# Altium project DE-060418.PrjPcb
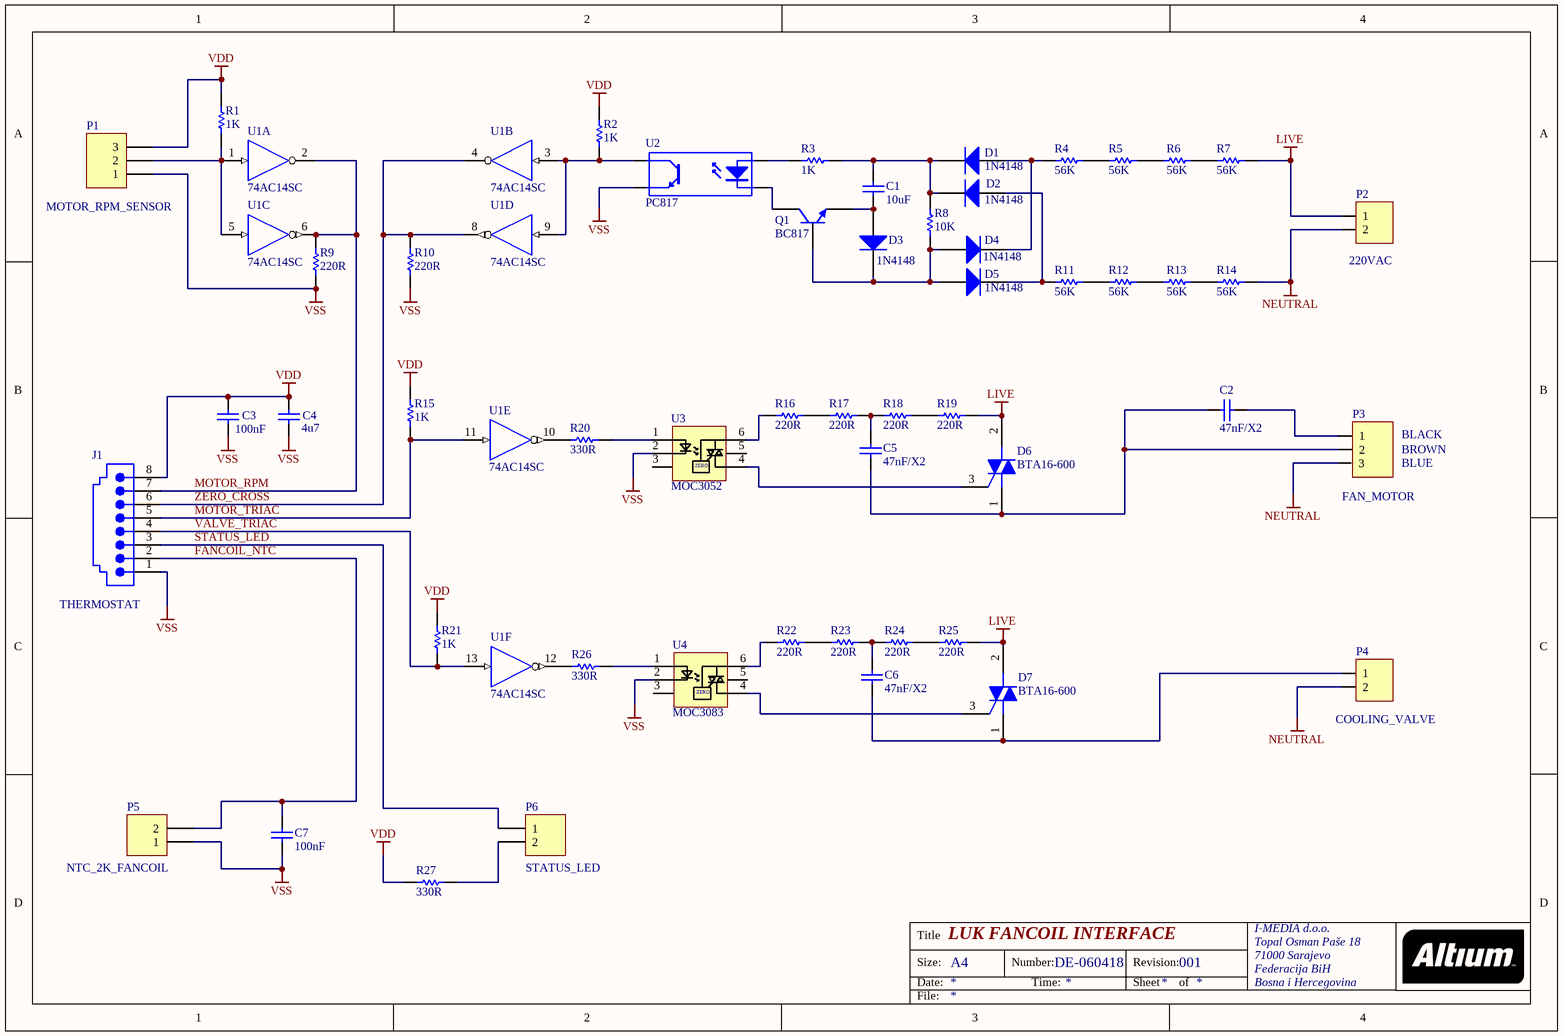
[diagram p0: DE-060418.SchDoc]
1 sheet, 53 parts. Net scope: global (net labels, ports and power ports of the same name join across sheets).
Board file: DE-060418.PcbDoc

## Sheet DE-060418.SchDoc: LUK FANCOIL INTERFACE
size A4; Author: Eldar Dedic; DrawnBy: eldar6776@hotmail.com; Organization: I-MEDIA d.o.o.; Address1: Topal Osman Paše 18; Address2: 71000 Sarajevo; Address3: Federacija BiH; Address4: Bosna i Hercegovina; DocumentNumber: DE-060418; Revision: 001

### Parts
C1  value 10uF  [0805]  (hidden comment: 4u7)
C2  47nF/X2  [VP52-2.5]
C3  100nF  [0603]
C4  4u7  [0805]
C5  47nF/X2  [VP52-2.5]
C6  47nF/X2  [VP52-2.5]
C7  100nF  [0603]
D1  1N4148  [SOD323]
D2  1N4148  [SOD323]
D3  1N4148  [SOD323]
D4  1N4148  [SOD323]
D5  1N4148  [SOD323]
D6  BTA16-600  [ONSC-TO-220-3-221A-07]
D7  BTA16-600  [ONSC-TO-220-3-221A-07]
J1  THERMOSTAT  [15-43-8501]
P1  MOTOR_RPM_SENSOR  [HDR1X3]
P2  220VAC  [TERMINAL BLOK 2]
P3  FAN_MOTOR  [TERMINAL BLOK 3]
P4  COOLING_VALVE  [TERMINAL BLOK 2]
P5  NTC_2K_FANCOIL  [HDR1X2]
P6  STATUS_LED  [HDR1X2]
Q1  BC817  [SOT23_N]
R1  1K  [6-0805]
R2  1K  [6-0805]
R3  1K  [6-0805]
R4  56K  [6-0805]
R5  56K  [6-0805]
R6  56K  [6-0805]
R7  56K  [6-0805]
R8  10K  [6-0805]
R9  220R  [6-0805]
R10  220R  [6-0805]
R11  56K  [6-0805]
R12  56K  [6-0805]
R13  56K  [6-0805]
R14  56K  [6-0805]
R15  1K  [6-0805]
R16  220R  [6-0805]
R17  220R  [6-0805]
R18  220R  [6-0805]
R19  220R  [6-0805]
R20  330R  [6-0805]
R21  1K  [6-0805]
R22  220R  [6-0805]
R23  220R  [6-0805]
R24  220R  [6-0805]
R25  220R  [6-0805]
R26  330R  [6-0805]
R27  330R  [6-0805]
U1  74AC14SC  [M14A_N]  (parts A,B,C,D,E,F of 6)
U2  PC817  [DIP-4]
U3  MOC3052  [DIP6]
U4  MOC3083  [DIP6]

### Nets
LIVE: D6.2(MT2) D7.2(MT2) P2.1 R7.2 R19.2 R25.2
NEUTRAL: P2.2 P3.3 P4.2 R14.2
VDD: C3.2 C4.2 J1.8 P1.3 R1.1 R2.1 R15.1 R21.1 R27.1 U1.14(VDD)
VSS: C3.1 C4.1 C7.1 J1.1 P1.1 P5.1 R9.2 R10.2 U1.7(VSS) U2.3(E) U3.2 U4.2
FANCOIL_NTC: C7.2 J1.2 P5.2
MOTOR_RPM: J1.7 R9.1 U1.2(~{O}) U1.6(~{O})
MOTOR_TRIAC: J1.5 R15.2 U1.11(I)
STATUS_LED: J1.3 P6.1
VALVE_TRIAC: J1.4 R21.2 U1.13(I)
ZERO_CROSS: J1.6 R10.1 U1.4(~{O}) U1.8(~{O})
NetC1_1: C1.1 D3.2(A) Q1.2(E)
NetC1_2: C1.2 D1.1(K) D2.1(K) R3.2 R8.2
NetC2_1: C2.1 C5.1 D6.1(MT1) P3.2
NetC2_2: C2.2 P3.1
NetC5_2: C5.2 R17.2 R18.1
NetC6_1: C6.1 D7.1(MT1) P4.1
NetC6_2: C6.2 R23.2 R24.1
NetD1_2: D1.2(A) D4.1(K) R4.1
NetD2_2: D2.2(A) D5.1(K) R11.1
NetD3_1: D3.1(K) D4.2(A) D5.2(A) Q1.1(B) R8.1
NetD6_3: D6.3(G) U3.4
NetD7_3: D7.3(G) U4.4
NetP1_2: P1.2 R1.2 U1.1(I) U1.5(I)
NetP6_2: P6.2 R27.2
NetQ1_3: Q1.3(C) U2.2(K)
NetR2_2: R2.2 U1.3(I) U1.9(I) U2.4(C)
NetR3_1: R3.1 U2.1(A)
NetR4_2: R4.2 R5.1
NetR5_2: R5.2 R6.1
NetR6_2: R6.2 R7.1
NetR11_2: R11.2 R12.1
NetR12_2: R12.2 R13.1
NetR13_2: R13.2 R14.1
NetR16_1: R16.1 U3.6
NetR16_2: R16.2 R17.1
NetR18_2: R18.2 R19.1
NetR20_1: R20.1 U3.1
NetR20_2: R20.2 U1.10(~{O})
NetR22_1: R22.1 U4.6
NetR22_2: R22.2 R23.1
NetR24_2: R24.2 R25.1
NetR26_1: R26.1 U4.1
NetR26_2: R26.2 U1.12(~{O})

Not connected (* = marked no-connect by the designer): U3 3 5; U4 3 5

### Notes on the sheet
- (near P3) BLACK
- (near P3) BLUE
- (near P3) BROWN
- Title
- Size:
- Date:
- A4
- Number:
- Time:
- Revision:
- Sheet
- of
- File:
- (in symbol MOC3081) ZERO

### Library data of the parts
C1 C4 = C0805: Ceramic Chip Capacitor - Standard; Note: Footprint corresponds to dimensions for bulk cassette packaging. This case size has tightened tolerances.; Published: 17-Jul-2002; LatestRevisionDate: 19-Mar-2004; LatestRevisionNote: Silkscreen size reduced.; DatasheetDocument: Mar-2001; PackageDocument: Mar-2001; PackageReference: 0805; Publisher: Altium Limited; Code_JEITA: 0805; Code_IPC: 2012[0805]; ComponentLink1Description: Manufacturer Link; ComponentLink1URL: http://www.kemet.com/; ComponentLink2Description: Datasheet; ComponentLink2URL: http://www.kemet.com/kemet/web/homepage/kechome.nsf/vapubfilesname/F3102TA.pdf/$file/F3102TA.pdf
  C4: Value: 4u7
C2 C5 C6 = VP52BA103: Dipped Radial Multilayer Ceramic Capacitor COG (NPO): 10nF; Note: See Datasheet for other packages & tolerances; Published: 17-Dec-2003; DatasheetDocument: 2-Jan-2002; PackageDocument: 8-Feb-2002; PackageReference: VP52-2.5; Publisher: Altium Limited; ComponentLink1Description: Manufacturer Link; ComponentLink1URL: http://www.vishay.com/; Value: 10nF
C3 C7 = C0603: Ceramic Chip Capacitor - Standard; Note: Footprint corresponds to dimensions for bulk cassette packaging. This case size has tightened tolerances.; Published: 17-Jul-2002; LatestRevisionDate: 19-Mar-2004; LatestRevisionNote: Silkscreen size reduced.; DatasheetDocument: Mar-2001; PackageDocument: Mar-2001; PackageReference: 0603; Publisher: Altium Limited; Code_JEITA: 0603; Code_IPC: 1608 [0603]; ComponentLink1Description: Manufacturer Link; ComponentLink1URL: http://www.kemet.com/; ComponentLink2Description: Datasheet; ComponentLink2URL: http://www.kemet.com/kemet/web/homepage/kechome.nsf/vapubfilesname/F3102TA.pdf/$file/F3102TA.pdf; Value: 100nF
D1-D5 = BAS321: General-purpose Diode; Published: 17-Sep-2003; LatestRevisionDate: 19-Mar-2004; LatestRevisionNote: Silkscreen size reduced.; DatasheetVersion: 9-Feb-1999; PackageVersion: May-1999; PackageReference: SOD323; Publisher: Altium Limited; PackageDescription: SOD-323/SC-76; 2 Leads; Body 1.7 x 1.3 mm, (LxW); ComponentLink1Description: Manufacturer Link; ComponentLink1URL: http://www.semiconductors.philips.com/; ComponentLink2Description: Datasheet; ComponentLink2URL: http://www.semiconductors.philips.com/acrobat/datasheets/BAS321_2.pdf
D6 D7 = BTA08-600BW3G: Triacs, Silicon Bidirectional Thyristor, 3-Pin TO-220, Pb-Free, Tube; Manufacturer: On Semiconductor; IGT Max (mA): 50; IT(RMS) Max (A): 8; ITSM Max (A): 90; DatasheetVersion: Rev. 1; PackageVersion: Rev. O, 07/2008; PackageReference: TO-220-3-221A-07; PackageDescription: 3-Pin Flange Mount, Vertical Straight Lead, Body 9.97 x 4.445 mm, Pitch 2.54 mm; Supplier 1: Digi-Key; Supplier Part Number 1: BTA08-600BW3G-ND; Supplier 2: Newark; Supplier Part Number 2: 13P2072; Supplier 3: Mouser; Supplier Part Number 3: 863-BTA08-600BW3G; Packing: Tube; RoHS: Pb-Free; Mounting Technology: Through Hole; PartNumber: BTA08-600BW3G; ComponentLink1Description: Manufacturer URL; ComponentLink1URL: http://www.onsemi.com/; ComponentLink2Description: Datasheet; ComponentLink2URL: http://www.onsemi.com/pub_link/Collateral/BTA08-600BW3-D.PDF; ComponentLink3Description: Package Specification; ComponentLink3URL: http://www.onsemi.com/pub_link/Collateral/221A-07.PDF
J1 = 15-43-8501: Right Angle, Standard Profile, RJ-45 Keyed, Unshielded PCB Jack; Ports: 1; Positions/Loaded: Port1 - 8 Keyed/8; PerformanceCategory: 3; PCB_Mounting: Thru-Hole; DrillSize: Nominal, Rounded to nearest 0.05mm; PCB_Layout: Complies with Manufacturer's Recommendation.; Published: 25-Jun-2002; DatasheetDocument: 18-Dec-2001; PackageDocument: 18-Dec-2001; PackageReference: 15-43-8501; Publisher: Altium Limited; ComponentLink1Description: Manufacturer Link; ComponentLink1URL: http://www.molex.com/; ComponentLink2Description: Datasheet; ComponentLink2URL: http://www.molex.com/cmc_upload/common_files/1212003_41687catalogpage.pdf; ComponentLink3Description: Iges Model; ComponentLink3URL: http://www.molex.com/pdm_docs/igs/15-43-8501_igs.zip
P1 = Header 3: Header, 3-Pin; LatestRevisionDate: 17-Jul-2002; LatestRevisionNote: Re-released for DXP Platform.; Publisher: Altium Limited
P2 P4 = TERMINAL BLOK 2: Terminal blok konektor 3,5 mm
P3 = TERMINAL BLOK 3: 3 pinski terminal blok konektor
P5 P6 = Header 2: Header, 2-Pin; LatestRevisionDate: 17-Jul-2002; LatestRevisionNote: Re-released for DXP Platform.; Publisher: Altium Limited
Q1 = BC817: NPN General-purpose Transistor; Published: 17-Sep-2003; LatestRevisionDate: 12-Dec-2006; LatestRevisionNote: IPC-7351 Footprint Added.; DatasheetVersion: Jun-1999; PackageVersion: May-1999; PackageReference: SOT23; Publisher: Altium Limited; PackageDescription: 3-Pin SOT-23 Package 0.95 mm Pitch, 2.3 mm Lead Span; ComponentLink1Description: Manufacturer Link; ComponentLink1URL: http://www.semiconductors.philips.com/; ComponentLink2Description: Datasheet; ComponentLink2URL: http://www.semiconductors.philips.com/acrobat/datasheets/BC817_BC817W_BC337_5.pdf
R1-R27 = ERJ6BQ: Low Ohmic Value Thick Film Chip Resistor, 0.22 Ohm to 9.1 Ohm Range, 1%, 2% and 5% Tolerance, 0805 Size, 0.25 W; Published: 17-Dec-2003; LatestRevisionDate: 19-Mar-2004; LatestRevisionNote: Silkscreen size reduced.; PackageDocument: Mar-2003; PackageReference: 6-0805; Publisher: Altium Limited; Code_IPC: 2012 [0805]; ComponentLink1Description: Manufacturer Link; ComponentLink1URL: http://www.panasonic.com/industrial/components/resistive_products.htm; ComponentLink2Description: Datasheet; ComponentLink2URL: http://www.panasonic.com/industrial/components/pdf/AOA0000CE3.pdf
U1 = 74AC14SC: Hex Schmitt-Trigger Inverter, 14-Pin SOIC, Commercial Grade; IC_Technology: AC; Published: 17-Jul-2002; LatestRevisionDate: 13-Apr-2006; LatestRevisionNote: IPC-7351 Footprint Added.; DatasheetVersion: Dec-1999; PackageVersion: 2000; PackageReference: M14A; Publisher: Altium Limited; PackageDescription: 14-Pin Small Outline Integrated Circuit 1.27 mm Pitch; Code_IPC: SOIC127P600-14; ComponentLink1Description: Manufacturer Link; ComponentLink1URL: http://www.fairchildsemi.com/; ComponentLink2Description: Datasheet; ComponentLink2URL: http://www.fairchildsemi.com/ds/74%2F74AC14.pdf
U2 = Optoisolator1: 4-Pin Phototransistor Optocoupler; Published: 24-Mar-1999; LatestRevisionDate: 04-Mar-2005; LatestRevisionNote: Sch pins 3 & 4 Swapped.; DatasheetVersion: Nov-2003; PackageReference: DIP-4; Publisher: Altium Limited
U3 U4 = MOC3081: Zero-Cross Optoisolator Triac Driver